# EAGLE design booster006 (EAGLE 4.16)
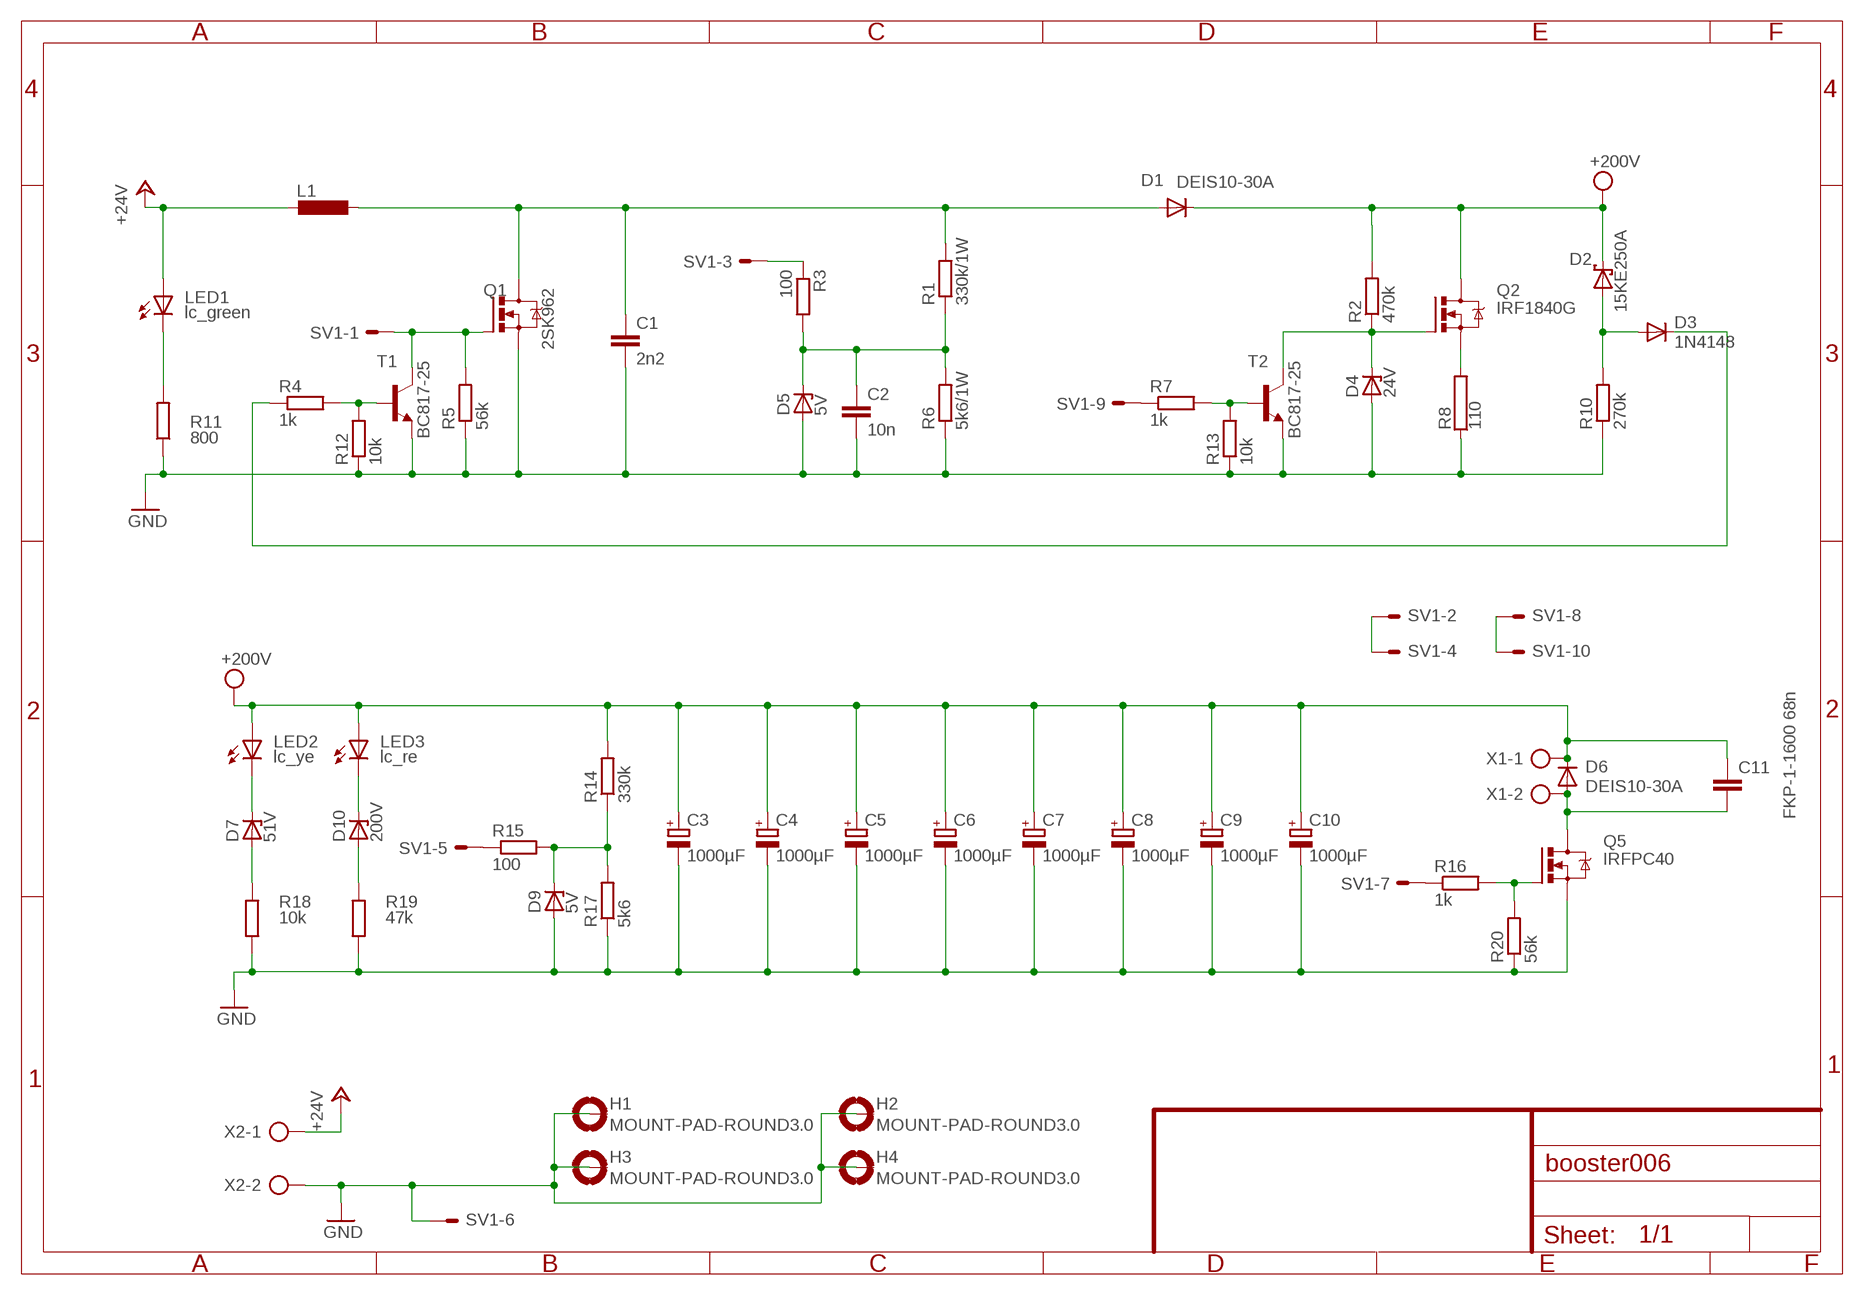
[diagram p0: schematic, sheet 1]

## Parts
C1  2n2  C-EU150-054X183  [C150-054X183]
C2  10n  C-EUC0603  [C0603]
C3  1000µF  CPOL-EUE10-35  [EB35D]
C4  1000µF  CPOL-EUE10-35  [EB35D]
C5  1000µF  CPOL-EUE10-35  [EB35D]
C6  1000µF  CPOL-EUE10-35  [EB35D]
C7  1000µF  CPOL-EUE10-35  [EB35D]
C8  1000µF  CPOL-EUE10-35  [EB35D]
C9  1000µF  CPOL-EUE10-35  [EB35D]
C10  1000µF  CPOL-EUE10-35  [EB35D]
C11  FKP-1-1600 68n  C-EU375-192X418  [C375-192X418]
D1  DEIS10-30A  [TO247AD]
D2  15KE250A  15KEXX  [CB429-17]
D3  1N4148  [DO35-10]
D4  24V  ZENER-DIODEDO35Z10  [DO35Z10]
D5  5V  ZENER-DIODEDO35Z10  [DO35Z10]
D6  DEIS10-30A  [TO247AD]
D7  51V  ZENER-DIODEDO35Z10  [DO35Z10]
D9  5V  ZENER-DIODEDO35Z10  [DO35Z10]
D10  200V  ZENER-DIODEF126-12  [F126Z12]
H1  MOUNT-PAD-ROUND3.0  [3,0-PAD]
H2  MOUNT-PAD-ROUND3.0  [3,0-PAD]
H3  MOUNT-PAD-ROUND3.0  [3,0-PAD]
H4  MOUNT-PAD-ROUND3.0  [3,0-PAD]
L1  L-EUTJ6-U1  [TJ6-U1]
LED1  lc_green  LED5MM  [LED5MM]
LED2  lc_ye  LED5MM  [LED5MM]
LED3  lc_re  LED5MM  [LED5MM]
Q1  2SK962  IRFPC40  [TO247BV]
Q2  IRF1840G  IRF740  [TO220BV]
Q5  IRFPC40  [TO247BV]
R1  330k/1W  R-EU_0309/12  [0309/12]
R2  470k  R-EU_R0805  [R0805]
R3  100  R-EU_R0805  [R0805]
R4  1k  R-EU_R0805  [R0805]
R5  56k  R-EU_R0805  [R0805]
R6  5k6/1W  R-EU_0309/12  [0309/12]
R7  1k  R-EU_R0805  [R0805]
R8  110  RHS25  [HS25]
R10  270k  R-EU_R0805  [R0805]
R11  800  R-EU_R0805  [R0805]
R12  10k  R-EU_R0805  [R0805]
R13  10k  R-EU_R0805  [R0805]
R14  330k  R-EU_R0805  [R0805]
R15  100  R-EU_R0805  [R0805]
R16  1k  R-EU_R0805  [R0805]
R17  5k6  R-EU_R0805  [R0805]
R18  10k  R-EU_R0805  [R0805]
R19  47k  R-EU_R0805  [R0805]
R20  56k  R-EU_R0805  [R0805]
SV1  ML10LE  [ML10L]
T1  BC817-25  BC817-25-NPN-SOT23-BEC  [SOT23-BEC]
T2  BC817-25  BC817-25-NPN-SOT23-BEC  [SOT23-BEC]
X1  AK500/2-H  [AK500/2-H]
X2  AK500/2-H  [AK500/2-H]

## Nets
+24V: L1.2 LED1.A X2.1
ADC_250V: C2.1 D5.C R1.1 R3.2 R6.2
ADC_250V1: D9.C R14.1 R15.2 R17.2
GND [Power]: C1.2 C2.2 C3.- C4.- C5.- C6.- C7.- C8.- C9.- C10.- D4.A D5.A D9.A H1.B3,0(MOUNT) H2.B3,0(MOUNT) H3.B3,0(MOUNT) H4.B3,0(MOUNT) Q1.S Q5.S R5.1 R6.1 R8.1 R10.1 R11.1 R12.1 R13.1 R17.1 R18.1 R19.1 R20.1 SV1.6 T1.E T2.E X2.2
N$1: D2.A D3.A R10.2
N$2: Q5.G R16.2 R20.2
N$3: D7.A R18.2
N$4: D3.C R4.1
N$5 [Power]: C11.2 D6.A Q5.D X1.2
N$6: D7.C LED2.K(C)
N$7: LED1.K(C) R11.2
N$8: R15.1 SV1.5
N$9: R3.1 SV1.3
N$11: R16.1 SV1.7
N$12: D10.A R19.2
N$13: D10.C LED3.K(C)
N$14: R7.1 SV1.9
N$15: SV1.8 SV1.10
N$16: SV1.2 SV1.4
N$18: D4.C Q2.G R2.1 T2.C
N$19: Q2.S R8.2
N$21: R7.2 R13.2 T2.B
N$23: R4.2 R12.2 T1.B
N$29: Q1.G R5.2 SV1.1 T1.C
N$32 [Power]: C1.1 D1.A L1.1 Q1.D R1.2
VPP: C3.+ C4.+ C5.+ C6.+ C7.+ C8.+ C9.+ C10.+ C11.1 D1.K(C) D2.C D6.K(C) LED2.A LED3.A Q2.D R2.2 R14.2 X1.1 ; supply symbol labelled +200V

## Library data of the parts
C1 C2 C11 = rcl:C-EU: CAPACITOR, European symbol
C3-C10 = rcl:CPOL-EU: POLARIZED CAPACITOR, European symbol
D1 D6 = carpenoctem:DEIS10-30A
D2 = diode:15KEXX: DIODE
D3 = diode:1N4148: DIODE high speed (Philips)
D4 D5 D7 D9 D10 = diode:ZENER-DIODE: Z-Diode
H1-H4 = holes:MOUNT-PAD-ROUND: MOUNTING PAD, round
L1 = rcl:L-EU: INDUCTOR, European symbol
LED1-LED3 = led:LED: LED OSRAM: - CHIPLED LG R971, LG N971, LY N971, LG Q971, LY Q971, LO R971, LY R971 LH N974, LH R974 LS Q976, LO Q976, LY Q976 LO Q996 - Hyper CHIPLED LW Q18S LB Q993, LB Q99A, LB R99A - SideLED LS A670, LO A670, LY A670, LG A670, LP A670 LB A673, LV A673, LT A673, LW A673 LH A674 LY A675 LS A676, LA A676, LO A676, LY A676, LW A676 LS A679, LY A679, LG A679 - Hyper Micro SIDELED® LS Y876, LA Y876, LO Y876, LY Y876 LT Y87S - SmartLED LW L88C, LW L88S LB L89C, LB L89S, LG L890 LS L89K, LO L89K, LY L89K LS L896, LA L896, LO L896, LY L896 - TOPLED LS T670, LO T670, LY T670, LG T670, LP T670 LSG T670, LSP T670, LSY T670, LOP T670, LYG T670 LG T671, LOG T671, LSG T671 LB T673, LV T673, LT T673, LW T673 LH T674 LS T676, LA T676, LO T676, LY T676, LB T676, LH T676, LSB T676, LW T676 LB T67C, LV T67C, LT T67C, LS T67K, LO T67K, LY T67K, LW E67C LS E67B, LA E67B, LO E67B, LY E67B, LB E67C, LV E67C, LT E67C LW T67C LS T679, LY T679, LG T679 LS T770, LO T770, LY T770, LG T770, LP T770 LB T773, LV T773, LT T773, LW T773 LH T774 LS E675, LA E675, LY E675, LS T675 LS T776, LA T776, LO T776, LY T776, LB T776 LHGB T686 LT T68C, LB T68C - Hyper Mini TOPLED® LB M676 - Mini TOPLED Santana® LG M470 LS M47K, LO M47K, LY M47K Source: http://www.osram.convergy.de - LUMILED® LXK2-PW12-R00, LXK2-PW12-S00, LXK2-PW14-U00, LXK2-PW14-V00 LXK2-PM12-R00, LXK2-PM12-S00, LXK2-PM14-U00 LXK2-PE12-Q00, LXK2-PE12-R00, LXK2-PE12-S00, LXK2-PE14-T00, LXK2-PE14-U00 LXK2-PB12-K00, LXK2-PB12-L00, LXK2-PB12-M00, LXK2-PB14-N00, LXK2-PB14-P00, LXK2-PB14-Q00 LXK2-PR12-L00, LXK2-PR12-M00, LXK2-PR14-Q00, LXK2-PR14-R00 LXK2-PD12-Q00, LXK2-PD12-R00, LXK2-PD12-S00 LXK2-PH12-R00, LXK2-PH12-S00 LXK2-PL12-P00, LXK2-PL12-Q00, LXK2-PL12-R00 Source: www.luxeon.com
Q1 Q5 = transistor-power:IRFPC40: N-CHANNEL MOS FET
Q2 = transistor-power:IRF740: N-CHANNEL MOS FET
R1-R7 R10-R20 = rcl:R-EU_: RESISTOR, European symbol
R8 = resistor-power:R: Power Resitor
SV1 = con-harting-ml:ML10?E: HARTING
T1 T2 = transistor:*-NPN-: NPN Transistror
X1 X2 = con-ptr500:AK500/2-H: CONNECTOR Aug. 2004 / PTR Meßtechnik: Die Bezeichnung der Serie AK505 wurde geändert. Es handelt sich hierbei um AK500 in horizontaler Ausführung.

## Net classes
1 Power: width 0.406 mm
2 High Power: width 2 mm

## Board
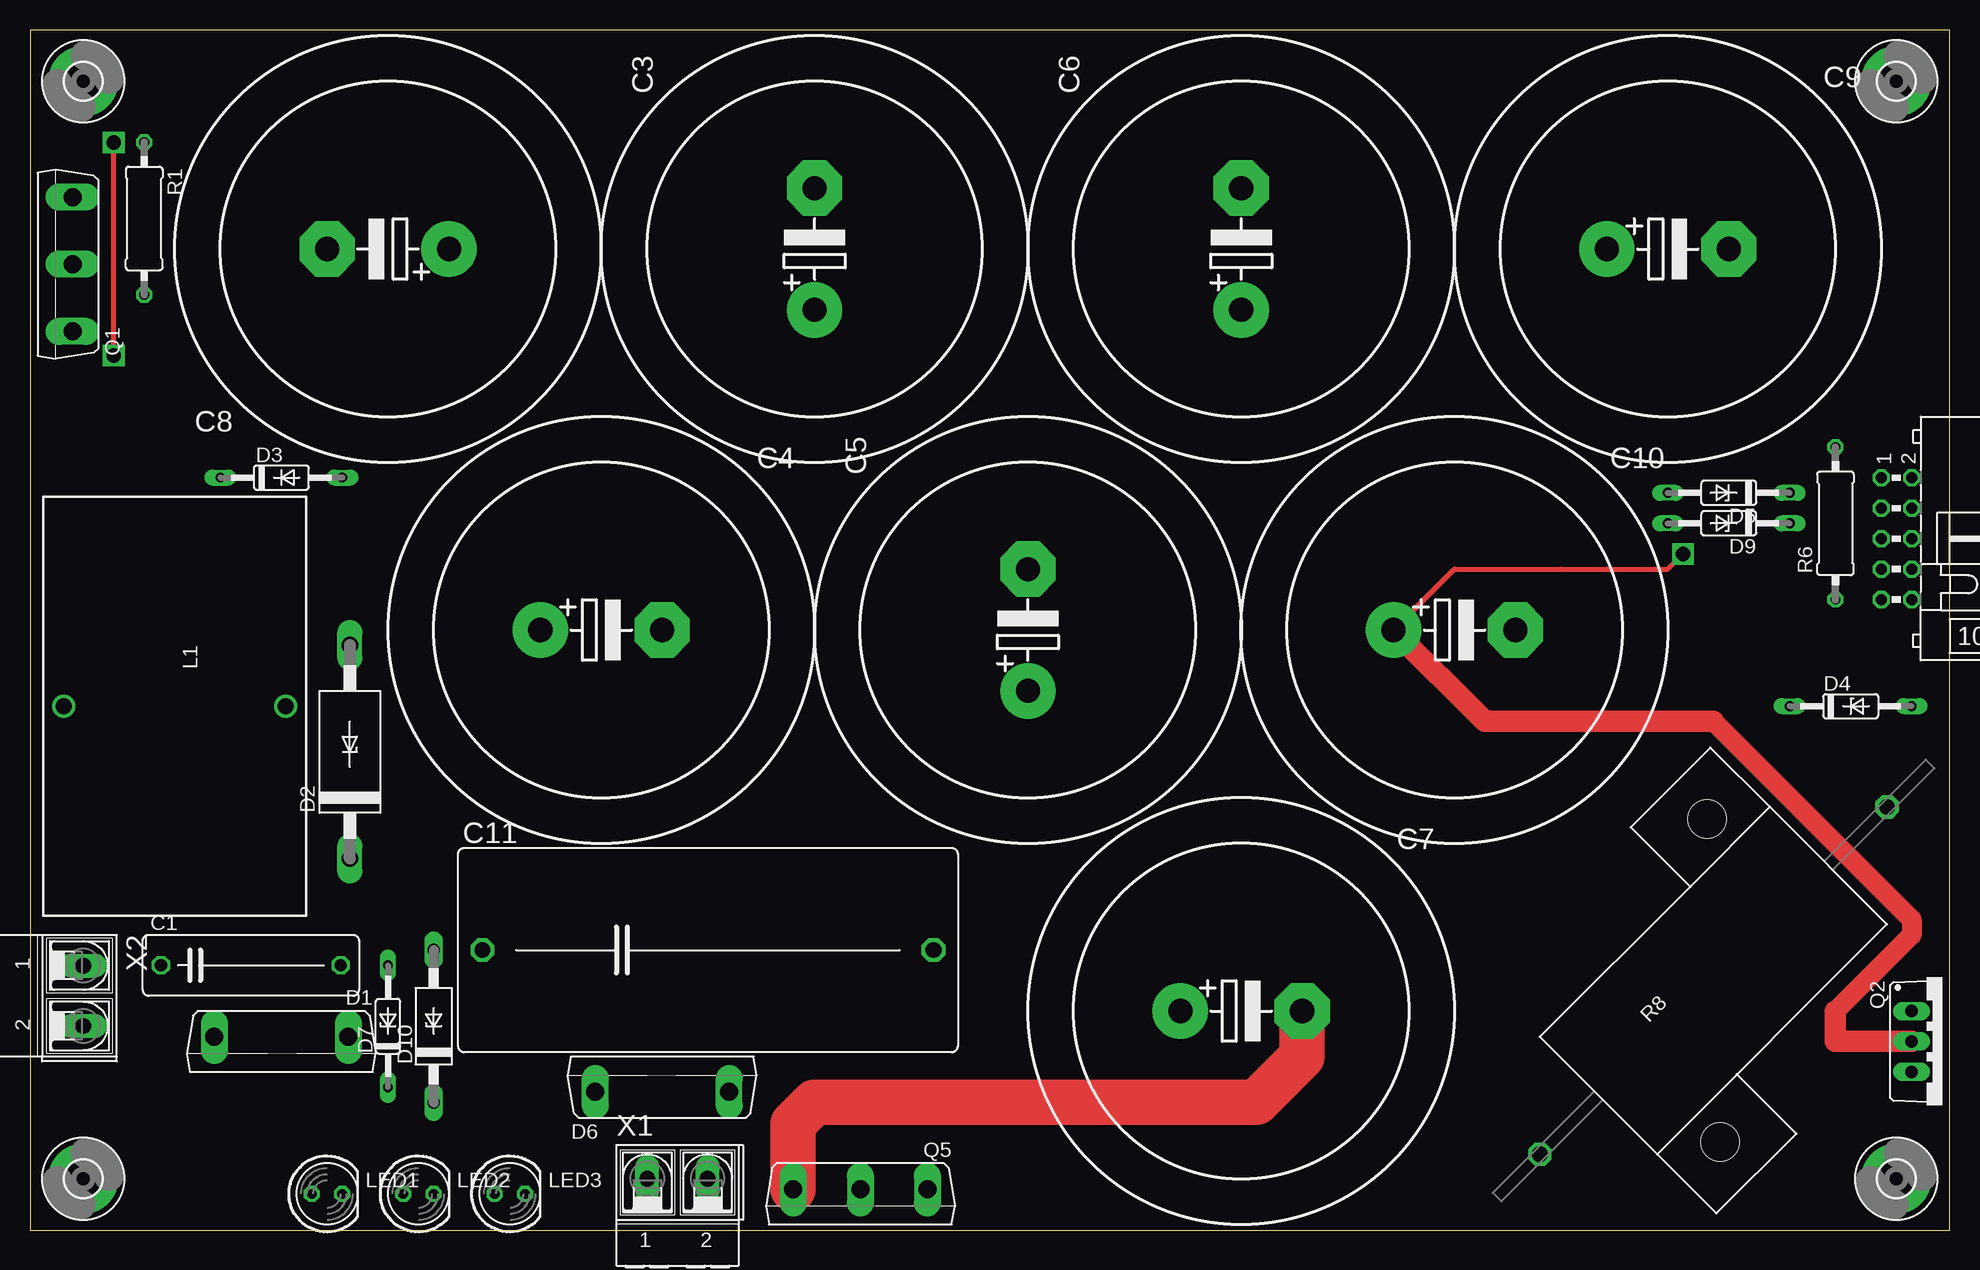
[diagram p1: board, top side]
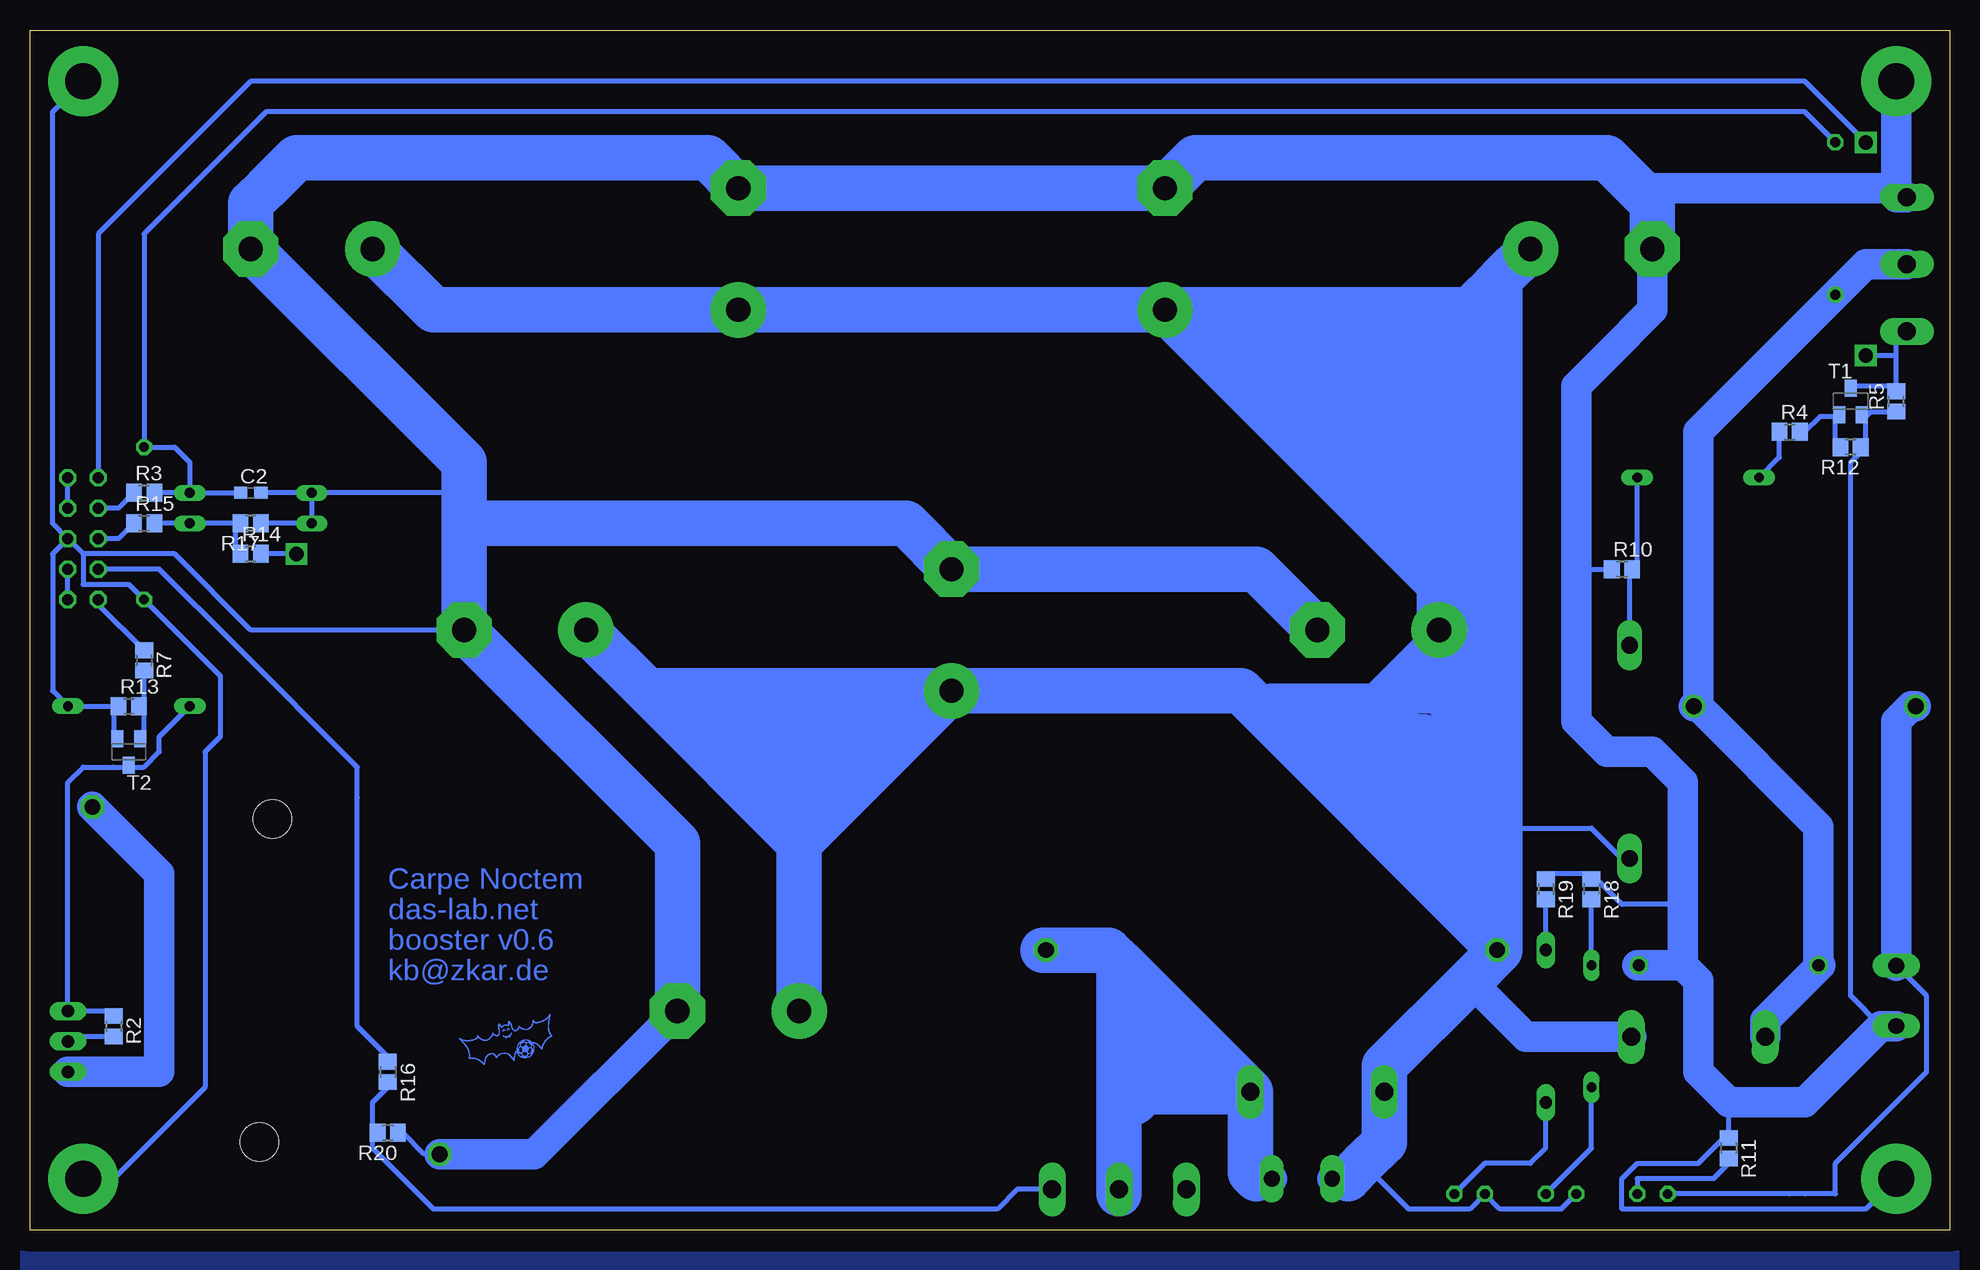
[diagram p2: board, bottom side, seen from below]

Size 160 x 100 mm. Coordinates in mm from the lower left corner, seen from the top.
Outline: 0,0 160,0 160,100 0,100 0,0
Copper layers (1*16): Top 0.035mm / dielectric 1.5mm / Bottom 0.035mm
Design rules "olimex_10mils": minimum track width 10mil, minimum drill 24mil, track to track 10mil, track to pad 10mil, pad to pad 10mil, via to via 10mil, smd to smd 10mil, copper to edge 40mil, drill to drill 10mil, minimum pad ring 10mil, minimum via ring 8mil, stop-mask expansion 0mil, vias tented up to drill 0mil, thermal gap 10mil

### Footprints (pad centres in the part's own frame; a part is rotated, then mirrored left to right if it is on the bottom)
C150-054X183 = drill 1.016 octagon: 1 -7.493,0; 2 7.493,0
C0603 = smd 1.1 x 1: 1 -0.85,0; 2 0.85,0
EB35D = drill 2.007 pad 4.597 round: + -5.08,0 | drill 2.007 pad 4.597 octagon: - 5.08,0
C375-192X418 = drill 1.321 octagon: 1 -18.796,0; 2 18.796,0
TO247AD = drill 1.499 long: A 5.588,-0.381; K -5.588,-0.381
CB429-17 = drill 1.397 long: A 8.89,0; C -8.89,0
DO35-10 = drill 0.813 long: A 5.08,0; C -5.08,0
DO35Z10 = drill 0.813 long: A 5.08,0; C -5.08,0
F126Z12 = drill 1.016 long: A 6.35,0; C -6.35,0
3,0-PAD = drill 3 pad 5.842 round: B3,0 0,0
TJ6-U1 = drill 1.3 round: 1 -9.25,0; 2 9.25,0
LED5MM = drill 0.813 octagon: A -1.27,0; K 1.27,0
TO247BV = drill 1.499 long: D 0,-2.921; G -5.588,-2.921; S 5.588,-2.921
TO220BV = drill 1.016 long: D 0,-2.54; G -2.54,-2.54; S 2.54,-2.54
0309/12 = drill 0.813 octagon: 1 -6.35,0; 2 6.35,0
R0805 = smd 1.3 x 1.5: 1 -0.85,0; 2 0.85,0
HS25 = drill 1.3 octagon: 1 -20.47,0; 2 20.47,0 | hole 3.2: 9.15,9.9; -9.15,-9.9
ML10L = drill 0.914 octagon: 1 -5.08,-1.27; 2 -5.08,1.27; 3 -2.54,-1.27; 4 -2.54,1.27; 5 0,-1.27; 6 0,1.27; 7 2.54,-1.27; 8 2.54,1.27; 9 5.08,-1.27; 10 5.08,1.27
SOT23-BEC = smd 1 x 1.4: B -0.95,-1.1; C 0,1.1; E 0.95,-1.1
AK500/2-H = drill 1.321 long: 1 -2.515,0; 2 2.515,0

### Placement (x,y rotation side)
C1  18.41,22.06 0 top
C2  141.6,61.43 0 bottom
C3  65.4,81.75 90 top
C4  47.62,50 0 top
C5  83.18,50 90 top
C6  100.96,81.75 90 top
C7  100.96,18.25 0 top
C8  29.84,81.75 180 top
C9  136.52,81.75 0 top
C10  118.74,50 0 top
C11  56.51,23.33 0 top
D1  20.95,15.71 180 top
D2  26.66,39.84 90 top
D3  20.95,62.7 0 top
D4  151.76,43.65 0 top
D5  141.6,61.43 180 top
D6  52.7,11.9 0 top
D7  29.84,16.98 90 top
D9  141.6,58.89 180 top
D10  33.65,16.98 90 top
H1  4.44,95.72 0 top
H2  155.57,95.72 0 top
H3  4.44,4.28 0 top
H4  155.57,4.28 0 top
L1  12.06,43.65 180 top
LED1  24.76,3.01 0 top
LED2  32.38,3.01 0 top
LED3  40,3.01 0 top
Q1  0.63,80.48 90 top
Q2  159.38,15.71 270 top
Q5  69.21,0.47 180 top
R1  9.52,84.29 270 top
R2  153.03,16.98 270 bottom
R3  150.49,61.43 0 bottom
R4  13.33,66.51 0 bottom
R5  4.44,69.05 90 bottom
R6  150.49,58.89 90 top
R7  150.49,47.46 270 bottom
R8  140.33,20.79 45 top
R10  27.3,55.08 0 bottom
R11  18.41,6.82 270 bottom
R12  8.25,65.24 180 bottom
R13  151.76,43.65 0 bottom
R14  141.6,56.35 0 bottom
R15  150.49,58.89 0 bottom
R16  130.17,13.17 270 bottom
R17  141.6,58.89 180 bottom
R18  29.84,28.41 270 bottom
R19  33.65,28.41 270 bottom
R20  130.17,8.09 180 bottom
SV1  155.57,57.62 270 top
T1  8.25,69.05 0 bottom
T2  151.76,39.84 180 bottom
U$1  [CN-LOGO-WIRE]  120.01,15.71 0 bottom
X1  53.97,4.28 0 top
X2  4.44,19.52 270 top

### Tracks (layer width: path | path; a pad name or v marks a point on that pad's centre or on a via)
+24V
  Bottom 0.406: 4.44,22.06 X2.1 4.44,22.06 | 4.44,22.06 3.17,22.06 | LED1.A 13.33,3.01 12.06,3.01 9.52,3.01 9.52,5.55 1.9,13.17 1.9,19.52 4.44,22.06
  Bottom 2.54: L1.2 3.17,43.65 4.44,42.38 4.44,22.06 X2.1
ADC_250V
  Bottom 0.406: D5.C C2.1 | D5.C R3.2 | D5.C 146.68,63.97 147.95,65.24 R6.2 150.49,83.02 140.33,93.18 12.06,93.18 R1.1
ADC_250V1
  Bottom 0.406: 142.87,58.89 R17.2 142.87,58.89 | 142.87,58.89 D9.C R15.2 | R14.1 142.87,56.77 142.87,58.89
GND
  Top 3.81: Q5.S 63.62,8.85 65.4,10.63 102.23,10.63 106.04,14.44 C7.-
  Bottom 0.406: 33.65,29.68 R19.1 | R19.1 33.23,29.68 | R18.1 29.42,29.68 | 4.44,16.98 X2.2 4.44,16.98 | H3.B3,0 6.98,1.74 27.3,1.74 27.3,4.28 26.03,5.55 20.95,5.55 19.68,6.82 18.41,8.09 | R18.1 29.84,29.68 33.65,29.68 | D5.A C2.2 | SV1.6 158.11,56.35 158.11,44.92 D4.A R13.1 153.03,43.65 153.03,41.26 T2.E | C9.- 141.6,80.48 | 123.82,61.43 D5.A | D5.A D9.A R17.1 | R20.1 128.9,8.09 127.13,6.32 R8.1 | H4.B3,0 153.03,4.28 145.41,11.9 145.41,39.84 144.14,41.11 144.14,44.92 144.14,46.19 R6.1 151.76,53.81 153.03,53.81 155.57,53.81 155.57,56.35 | C10.- 141.6,50 147.95,56.35 155.57,56.35 | H2.B3,0 158.11,93.18 158.11,58.89 SV1.6 | 4.44,16.98 5.71,16.98 8.25,19.52 8.25,61.43 8.25,63.97 6.98,65.24 R12.1 6.98,65.66 6.98,67.78 | 31.11,55.08 R10.1 | 18.41,8.09 R11.1 18.41,8.09 | 18.41,8.09 18.41,10.63 | 155.57,56.35 SV1.6 | 33.65,29.68 R19.1 | R18.1 29.42,29.26 27.3,27.14 23.49,27.14 22.22,28.41 | 6.98,67.78 7.15,67.95 T1.E 7.13,67.78 6.98,67.78 | R5.1 6.56,68.2 6.98,67.78
  Bottom 2.54: 4.44,86.07 Q1.S | 4.44,86.07 H1.B3,0 | 26.03,22.06 C1.2 | C8.- 24.76,76.67 28.57,72.86 31.11,70.32 31.11,55.08 31.11,42.38 28.57,39.84 24.76,39.84 22.22,37.3 22.22,28.41 22.22,25.87 22.22,22.06 | 4.44,86.07 5.2,86.83 26.03,86.83 | 26.03,22.06 C1.2 | 4.44,16.98 5.71,16.98 12.06,10.63 18.41,10.63 20.95,13.17 20.95,16.98 20.95,20.79 22.22,22.06 | 26.03,22.06 C1.2 | 26.03,22.06 C1.2 | 22.22,22.06 26.03,22.06 | R8.1 117.97,6.32 C7.-
  Bottom 3.81: C8.- 24.76,85.56 26.03,86.83 28.57,89.37 62.86,89.37 C3.- C6.- 103.5,89.37 137.79,89.37 140.33,86.83 141.6,85.56 C9.- 123.82,63.97 123.82,61.43 123.82,58.89 | 123.82,58.89 86.99,58.89 C5.- 57.78,55.08 C4.- | 123.82,58.89 C10.- 106.04,32.22 C7.-
  pour Bottom (isolate 1.778): 160.65,-3.34 -0.64,-3.34 -0.64,-0.8 160.65,-0.8
N$1
  Bottom 0.406: 26.03,55.08 R10.2 26.03,55.08 | D2.A 26.66,54.45 26.03,55.08 | 26.03,55.08 D3.A
N$2
  Bottom 0.406: Q5.G 77.72,3.39 79.37,1.74 111.12,1.74 126.36,1.74 131.44,6.82 131.44,8.09 | 131.44,8.09 R20.2 | R16.2 130.17,11.9 131.44,10.63 131.44,8.09
N$3
  Bottom 0.406: 29.84,27.14 R18.2 29.84,27.14 | D7.A 29.84,27.14
N$4
  Bottom 0.406: R4.1 14.18,64.39 D3.C
N$5
  Bottom 2.54: X1.2 57.78,4.28
  Bottom 3.81: D6.A 67.05,11.52 | 67.05,11.52 67.94,10.63 | Q5.D 69.21,3.01 69.21,9.36 69.21,22.06 69.02,22.25 | C11.2 75.56,23.33 70.1,23.33 69.02,22.25 | D6.A 69.02,22.25 | D6.A 58.29,4.79 57.78,4.28 | 67.05,11.52 67.05,13.17 64.13,13.17 64.13,16.98 67.94,16.98
N$6
  Bottom 0.406: LED2.K 29.84,6.82 D7.C
N$7
  Bottom 0.406: LED1.K 26.03,4.28 19.68,4.28 18.41,5.55 R11.2
N$8
  Bottom 0.406: R15.1 152.61,57.62 SV1.5
N$9
  Bottom 0.406: R3.1 152.61,60.16 SV1.3
N$11
  Bottom 0.406: SV1.7 151.76,55.08 149.22,55.08 142.87,48.73 132.71,38.57 132.71,36.03 132.71,16.98 130.17,14.44 R16.1
N$12
  Bottom 0.406: 33.65,27.14 R19.2 33.65,27.14 | D10.A 33.65,27.14
N$13
  Bottom 0.406: LED3.K 38.73,5.55 34.92,5.55 33.65,6.82 D10.C
N$14
  Bottom 0.406: 154.3,52.12 SV1.9 154.3,52.12 | R7.1 154.3,52.12
N$15
  Bottom 0.406: SV1.10 SV1.8
N$16
  Bottom 0.406: SV1.4 SV1.2
N$18
  Bottom 0.406: R2.1 153.45,18.25 Q2.G 156.84,37.3 155.57,38.57 153.03,38.57 151.76,38.57 | D4.C 149.22,41.11 149.22,39.84 150.49,38.57 151.76,38.57 | 151.76,38.57 T2.C 151.76,38.57
N$19
  Bottom 2.54: Q2.S 149.22,13.17 149.22,29.68 R8.2
N$21
  Bottom 0.406: 150.49,43.65 R13.2 150.49,43.65 | T2.B 150.49,41.26 150.49,43.65 | 150.49,43.65 R7.2
N$23
  Bottom 0.406: 9.52,67.78 9.37,67.78 | 9.37,67.78 T1.B 9.37,67.78 | R12.2 9.52,65.66 9.52,67.78 | 9.52,67.78 9.37,67.78 | R4.2 12.06,66.51 10.79,67.78 9.52,67.78
N$29  (via drill 1.2 pad 1.78)
  Top 0.406: v6.98,72.86 v6.98,90.64
  Bottom 0.406: 4.44,70.32 R5.2 4.44,70.32 | T1.C 8.08,70.32 4.44,70.32 | 4.44,70.32 4.44,72.86 | 4.44,72.86 4.44,74 Q1.G 4.06,75.4 | 4.44,72.86 v6.98,72.86 | SV1.1 154.3,83.02 141.6,95.72 12.06,95.72 v6.98,90.64
N$32
  Bottom 0.406: 10.79,22.06 C1.1
  Bottom 2.54: 20.95,43.65 L1.1 | 20.95,43.65 20.95,66.51 R1.2 6.98,80.48 Q1.D | 20.95,43.65 L1.1 | 20.95,43.65 L1.1 | 20.95,43.65 10.92,33.62 C1.1 10.79,22.06 15.36,17.49 D1.A
VPP  (via drill 1.2 pad 1.78)
  Top 0.406: C10.+ 118.74,55.08 127.63,55.08 131.44,55.08 136.52,55.08 v137.79,56.35
  Top 1.676: 150.49,18.25 156.84,24.6 156.84,25.87 140.33,42.38
  Top 1.778: Q2.D 150.49,15.71 150.49,18.25 | 140.33,42.38 137.79,42.38 121.28,42.38 C10.+
  Bottom 0.406: 48.89,5.55 45.08,1.74 40,1.74 LED3.A 37.46,1.74 32.38,1.74 LED2.A | 95.88,22.06 94.61,23.33 | R2.2 156.42,16.13 Q2.D | R14.2 140.33,56.35 v137.79,56.35 | D2.C 27.3,30.95 29.84,33.49 37.46,33.49
  Bottom 2.54: 50.16,4.28 X1.1 | 37.46,23.33 C11.1 | D1.K 30.22,16.09 35.3,16.09 40,20.79
  Bottom 3.81: 37.46,23.33 C11.1 37.46,23.33 | 37.46,23.33 40,20.79 47.11,13.68 D6.K 47.11,7.33 48.89,5.55 50.16,4.28 | 37.46,23.33 59.05,44.92 C5.+ | C4.+ 37.46,44.92 37.46,33.49 37.46,30.95 37.46,23.33 | 40,76.67 42.54,74.13 C4.+ | 40,76.67 38.73,77.94 | 38.73,77.94 37.46,79.21 | 37.46,79.21 C8.+ | C3.+ 40,76.67 | C4.+ 42.54,53.81 C3.+ | C3.+ 61.59,76.67 45.08,60.16 45.08,72.86 46.35,74.13 55.24,74.13 56.51,72.86 53.97,72.86 47.62,66.51 47.62,70.32 48.89,71.59 | C9.+ 126.36,76.67 C6.+ C3.+ | 108.58,44.92 C10.+ | C5.+ 108.58,44.92 | 95.88,32.22 95.88,22.06 C7.+ | 108.58,44.92 95.88,32.22 | C5.+ 95.88,32.22 | 95.88,32.22 95.88,36.03 102.23,42.38 89.53,42.38 94.61,37.3 94.61,38.57 95.88,39.84 | C4.+ 42.54,48.73 47.62,43.65 56.51,43.65 55.24,43.65 40,28.41 40,42.38 42.54,44.92 45.08,44.92 48.89,41.11 42.54,34.76 42.54,39.84 43.81,41.11 46.35,41.11 | C4.+ 38.73,53.81 | 38.73,53.81 38.73,74.13 38.73,77.94 | 40,76.67 38.73,77.94 | 40,76.67 40,43.65 38.73,44.92 38.73,53.81 | 38.73,53.81 38.73,39.84 37.46,41.11 37.46,79.21

### Text on the board
Bottom: Carpe Noctem | das-lab.net | booster v0.6 | kb@zkar.de